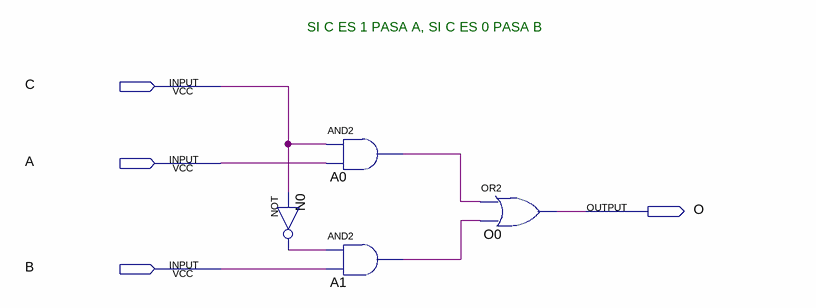
[diagram p0: schematic sheet]
// Quartus schematic mux2.bdf as structural Verilog: 4 symbols, 4 pins
module mux2 (
  input  C,
  input  A,
  input  B,
  output O
);

  wire A0_out, A1_out, N0_out;

  not N0 (N0_out, C);
  and A0 (A0_out, C, A);
  and A1 (A1_out, N0_out, B);
  or O0 (O, A0_out, A1_out);

  // Notes on the sheet:
  //   SI C ES 1 PASA A, SI C ES 0 PASA B
endmodule
